# Altium schematic sheet future_connector.SchDoc
size A4
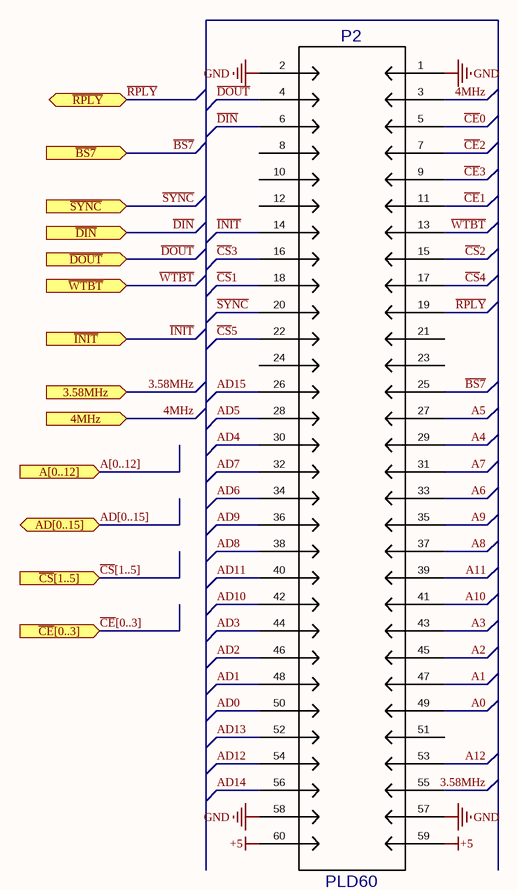
[diagram p0: future_connector.SchDoc]

## Parts
P2  PLD60  [PLD60]

## Ports
3.58MHz (in), 4MHz (in), A[0..12] (in), AD[0..15] (bidir), ~{BS7} (in), ~{CE}[0..3] (in), ~{CS}[1..5] (in), ~{DIN} (in), ~{DOUT} (in), ~{INIT} (in), ~{RPLY} (bidir), ~{SYNC} (in), ~{WTBT} (in)

## Nets
+5: P2.59 P2.60
GND: P2.1 P2.2 P2.57 P2.58
3.58MHz: P2.55 ; port 3.58MHz
4MHz: P2.3 ; port 4MHz
A0: P2.49
A1: P2.47
A2: P2.45
A3: P2.43
A4: P2.29
A5: P2.27
A6: P2.33
A7: P2.31
A8: P2.37
A9: P2.35
A10: P2.41
A11: P2.39
A12: P2.53
AD0: P2.50
AD1: P2.48
AD2: P2.46
AD3: P2.44
AD4: P2.30
AD5: P2.28
AD6: P2.34
AD7: P2.32
AD8: P2.38
AD9: P2.36
AD10: P2.42
AD11: P2.40
AD12: P2.54
AD13: P2.52
AD14: P2.56
AD15: P2.26
~{BS7}: P2.25 ; port ~{BS7}
~{CE}0: P2.5
~{CE}1: P2.11
~{CE}2: P2.7
~{CE}3: P2.9
~{CS}1: P2.18
~{CS}2: P2.15
~{CS}3: P2.16
~{CS}4: P2.17
~{CS}5: P2.22
~{DIN}: P2.6 ; port ~{DIN}
~{DOUT}: P2.4 ; port ~{DOUT}
~{INIT}: P2.14 ; port ~{INIT}
~{RPLY}: P2.19 ; port ~{RPLY}
~{SYNC}: P2.20 ; port ~{SYNC}
~{WTBT}: P2.13 ; port ~{WTBT}

Not connected (* = marked no-connect by the designer): P2 8 10 12 21 23 24 51

## Buses and harness runs
bus A[0..12] = port A[0..12]
bus AD[0..15] = port AD[0..15]
bus ~{CE}[0..3] = port ~{CE}[0..3]
bus ~{CS}[1..5] = port ~{CS}[1..5]

## Library data of the parts
P2 = PLD60: Value: *